# Altium schematic sheet MARS_PORB.SchDoc: My title
size A3; Organization: University of California; Address1: 475 Portola Plaza; Address2: Los Angeles, CA 90095; DocumentNumber: 35; Revision: R01; SheetNumber: 35; SheetTotal: 35
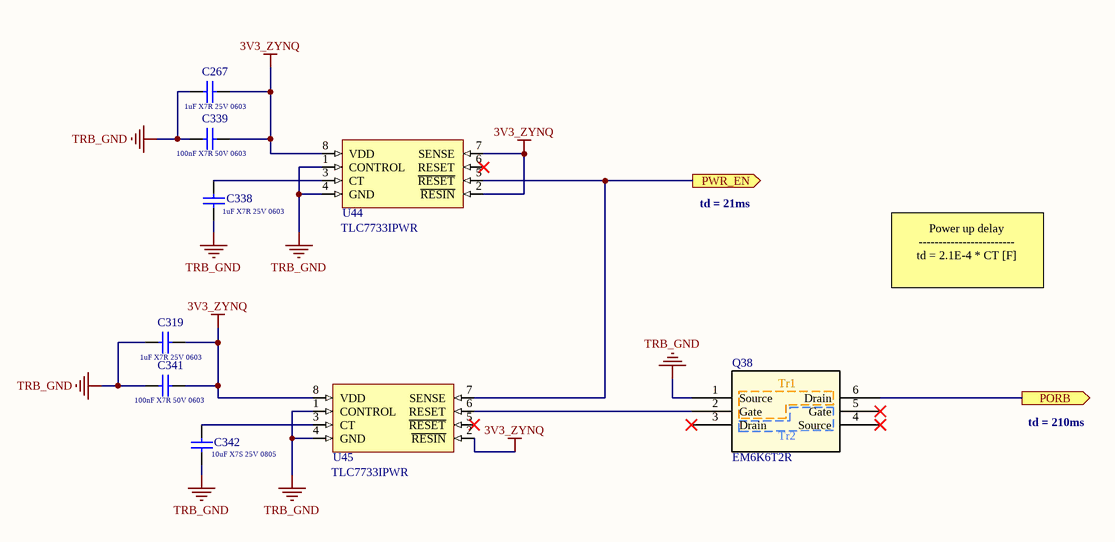
[diagram p0: MARS_PORB.SchDoc]

## Parts
C267  Capacitance: 1uF X7R 25V 0603  [Cap_Murata_GCJ188R71E105KA01J_1uF]  (hidden comment: Cap_Murata_GCJ188R71E105KA01J_1uF)
C319  Capacitance: 1uF X7R 25V 0603  [Cap_Murata_GCJ188R71E105KA01J_1uF]  (hidden comment: Cap_Murata_GCJ188R71E105KA01J_1uF)
C338  Capacitance: 1uF X7R 25V 0603  [Cap_Murata_GCJ188R71E105KA01J_1uF]  (hidden comment: Cap_Murata_GCJ188R71E105KA01J_1uF)
C339  Capacitance: 100nF X7R 50V 0603  [Cap_Kemet_C0603C104M5RACAUTO_100nF]  (hidden comment: Cap_Kemet_C0603C104M5RACAUTO_100nF)
C341  Capacitance: 100nF X7R 50V 0603  [Cap_Kemet_C0603C104M5RACAUTO_100nF]  (hidden comment: Cap_Kemet_C0603C104M5RACAUTO_100nF)
C342  Capacitance: 10uF X7S 25V 0805  [Cap_Murata_ GRM21BC71E106ME11L_10uF]  (hidden comment: Cap_Murata_ GRM21BC71E106ME11L_10uF)
Q38  EM6K6T2R  [TRANS_EM6_ROM]
U44  TLC7733IPWR  [PMU_Texas_Instruments_TLC7733IPWR_2.93]
U45  TLC7733IPWR  [PMU_Texas_Instruments_TLC7733IPWR_2.93]

## Ports
PORB (out), PWR_EN (out)

## Nets
3V3_ZYNQ: C267.1 C319.1 C339.1 C341.1 U44.2(~{RESIN}) U44.7(SENSE) U44.8(VDD) U45.2(~{RESIN}) U45.8(VDD)
TRB_GND: C267.2 C319.2 C338.1 C339.2 C341.2 C342.2 Q38.1(Source) U44.1(CONTROL) U44.4(GND) U45.1(CONTROL) U45.4(GND)
PORB: Q38.6(Drain) ; port PORB
PWR_EN: U44.5(~{RESET}) U45.7(SENSE) ; port PWR_EN
NetC338_2: C338.2 U44.3(CT)
NetC342_1: C342.1 U45.3(CT)
NetQ38_2: Q38.2(Gate) U45.6(RESET)

Not connected (* = marked no-connect by the designer): Q38 3(Drain)* 4(Source)* 5(Gate)*; U44 6(RESET)*; U45 5(~{RESET})*

## Notes on the sheet
- td = 21ms
- Power up delay
  ------------------------
  td = 2.1E-4 * CT [F]
- td = 210ms
- 475 Portola Plaza
- GAPS TOF
- igarcia91@g.ucla.edu
- Los Angeles, CA
- 310-825-0344
- Size:
- Date:
- Letter
- Revision:
- Time:
- Sheet
- of
- andrew.peck@cern.ch
- spq@ucla.edu
- File:
- (in symbol EM6K6T2R) Tr1; Tr2

## Library data of the parts
C267 C319 C338 = Cap_Murata_GCJ188R71E105KA01J_1uF: CAP CER 1uF 25V X7R 0603; Supplier 1: Mouser; Supplier Part Number 1: 81-GCJ188R71E105KA1J
C339 C341 = Cap_Kemet_C0603C104M5RACAUTO_100nF: CAP CER 100nF 50V X7R 0603; Supplier 1: Mouser; Supplier Part Number 1: 80-C0603C104M5RAUTO
C342 = Cap_Murata_ GRM21BC71E106ME11L_10uF: CAP CER 10uF 25V X7R 0805; Supplier 1: Mouser; Supplier Part Number 1: 81-GRM21BC71E106ME1L
Q38 = EM6K6T2R: MOSFET Small Signal Dual N-CH 20V .3A .15W; Vendor: ROHM Semiconductor; Manufacturer_Part_Number: EM6K6T2R
U44 U45 = PMU_Texas_Instruments_TLC7733IPWR_2.93: Supervisory Circuits 2.93V Monitor; Manufacturer 1: Texas Instruments; Manufacturer Part Number 1: TLC7733IPWR; Supplier 1: Mouser; Supplier Part Number 1: 595-TLC7733IPWR